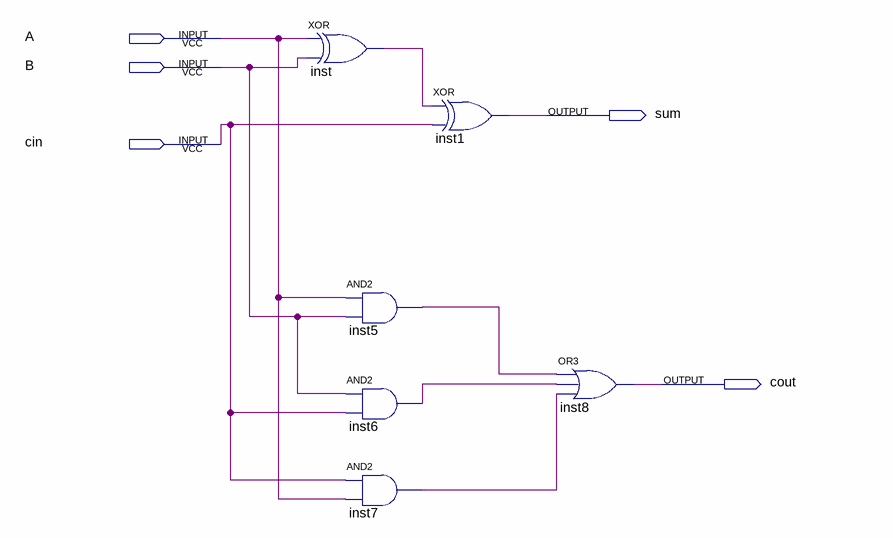
[diagram p0: schematic sheet]
// Quartus schematic fulladdergate.bdf as structural Verilog: 6 symbols, 5 pins
module fulladdergate (
  input  A,
  input  B,
  input  cin,
  output sum,
  output cout
);

  wire inst5_out, inst6_out, inst7_out, inst_out;

  xor inst (inst_out, A, B);
  and inst5 (inst5_out, A, B);
  and inst6 (inst6_out, B, cin);
  and inst7 (inst7_out, cin, A);
  xor inst1 (sum, inst_out, cin);
  or inst8 (cout, inst5_out, inst6_out, inst7_out);
endmodule
